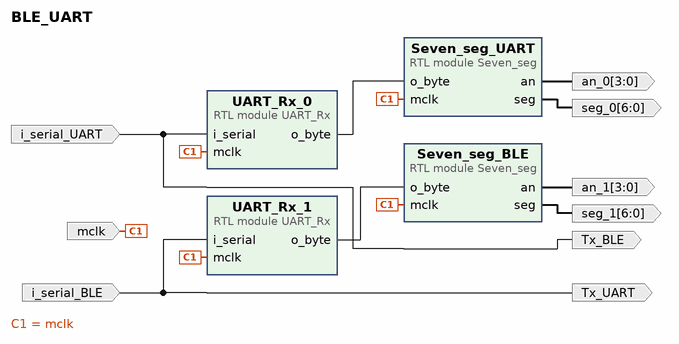
[diagram p0: block diagram of the top level]
# Vivado block design BLE_UART, xc7s50csga324-1, Vivado 2017.4
create_bd_design BLE_UART

create_bd_port -dir I mclk
create_bd_port -dir I i_serial_UART
create_bd_port -dir O -from 3 -to 0 an_0
create_bd_port -dir O -from 6 -to 0 seg_0
create_bd_port -dir O Tx_BLE
create_bd_port -dir I i_serial_BLE
create_bd_port -dir O Tx_UART
create_bd_port -dir O -from 3 -to 0 an_1
create_bd_port -dir O -from 6 -to 0 seg_1

create_bd_cell -type module -reference Seven_seg Seven_seg_UART
create_bd_cell -type module -reference UART_Rx UART_Rx_0
create_bd_cell -type module -reference UART_Rx UART_Rx_1
create_bd_cell -type module -reference Seven_seg Seven_seg_BLE

# ---- connections ----

connect_bd_net -net mclk_0_1 [get_bd_ports mclk] \
  [get_bd_pins UART_Rx_0/mclk] [get_bd_pins Seven_seg_UART/mclk] [get_bd_pins UART_Rx_1/mclk] \
  [get_bd_pins Seven_seg_BLE/mclk]
connect_bd_net -net i_serial_0_1 [get_bd_ports i_serial_UART] [get_bd_pins UART_Rx_0/i_serial] [get_bd_ports Tx_BLE]
connect_bd_net -net Seven_seg_0_an [get_bd_pins Seven_seg_UART/an] [get_bd_ports an_0]
connect_bd_net -net Seven_seg_0_seg [get_bd_pins Seven_seg_UART/seg] [get_bd_ports seg_0]
connect_bd_net [get_bd_pins UART_Rx_0/o_byte] [get_bd_pins Seven_seg_UART/o_byte]
connect_bd_net -net i_serial_1_1 [get_bd_ports i_serial_BLE] [get_bd_pins UART_Rx_1/i_serial] [get_bd_ports Tx_UART]
connect_bd_net [get_bd_pins UART_Rx_1/o_byte] [get_bd_pins Seven_seg_BLE/o_byte]
connect_bd_net -net Seven_seg_1_an [get_bd_pins Seven_seg_BLE/an] [get_bd_ports an_1]
connect_bd_net -net Seven_seg_1_seg [get_bd_pins Seven_seg_BLE/seg] [get_bd_ports seg_1]

validate_bd_design
save_bd_design
